# EasyEDA Pro project Distribution-board_2026-02-21.epro

# Schematic Distribution-board
Board Name: Board1; Create Date: 2026-01-16; Page Name: P1; Project Name: 莺飞; Schematic Name: Schematic7; Update Date: 2026-01-16; BladeWidth: 10; Company: 嘉立创EDA; Page Size: A4; RegionStart: 1; ShowBorder: 1; TitleBlock: 1; TitleBlockPosition: 3; Version: V1.0; XRegionCount: 6; YRegionCount: 4
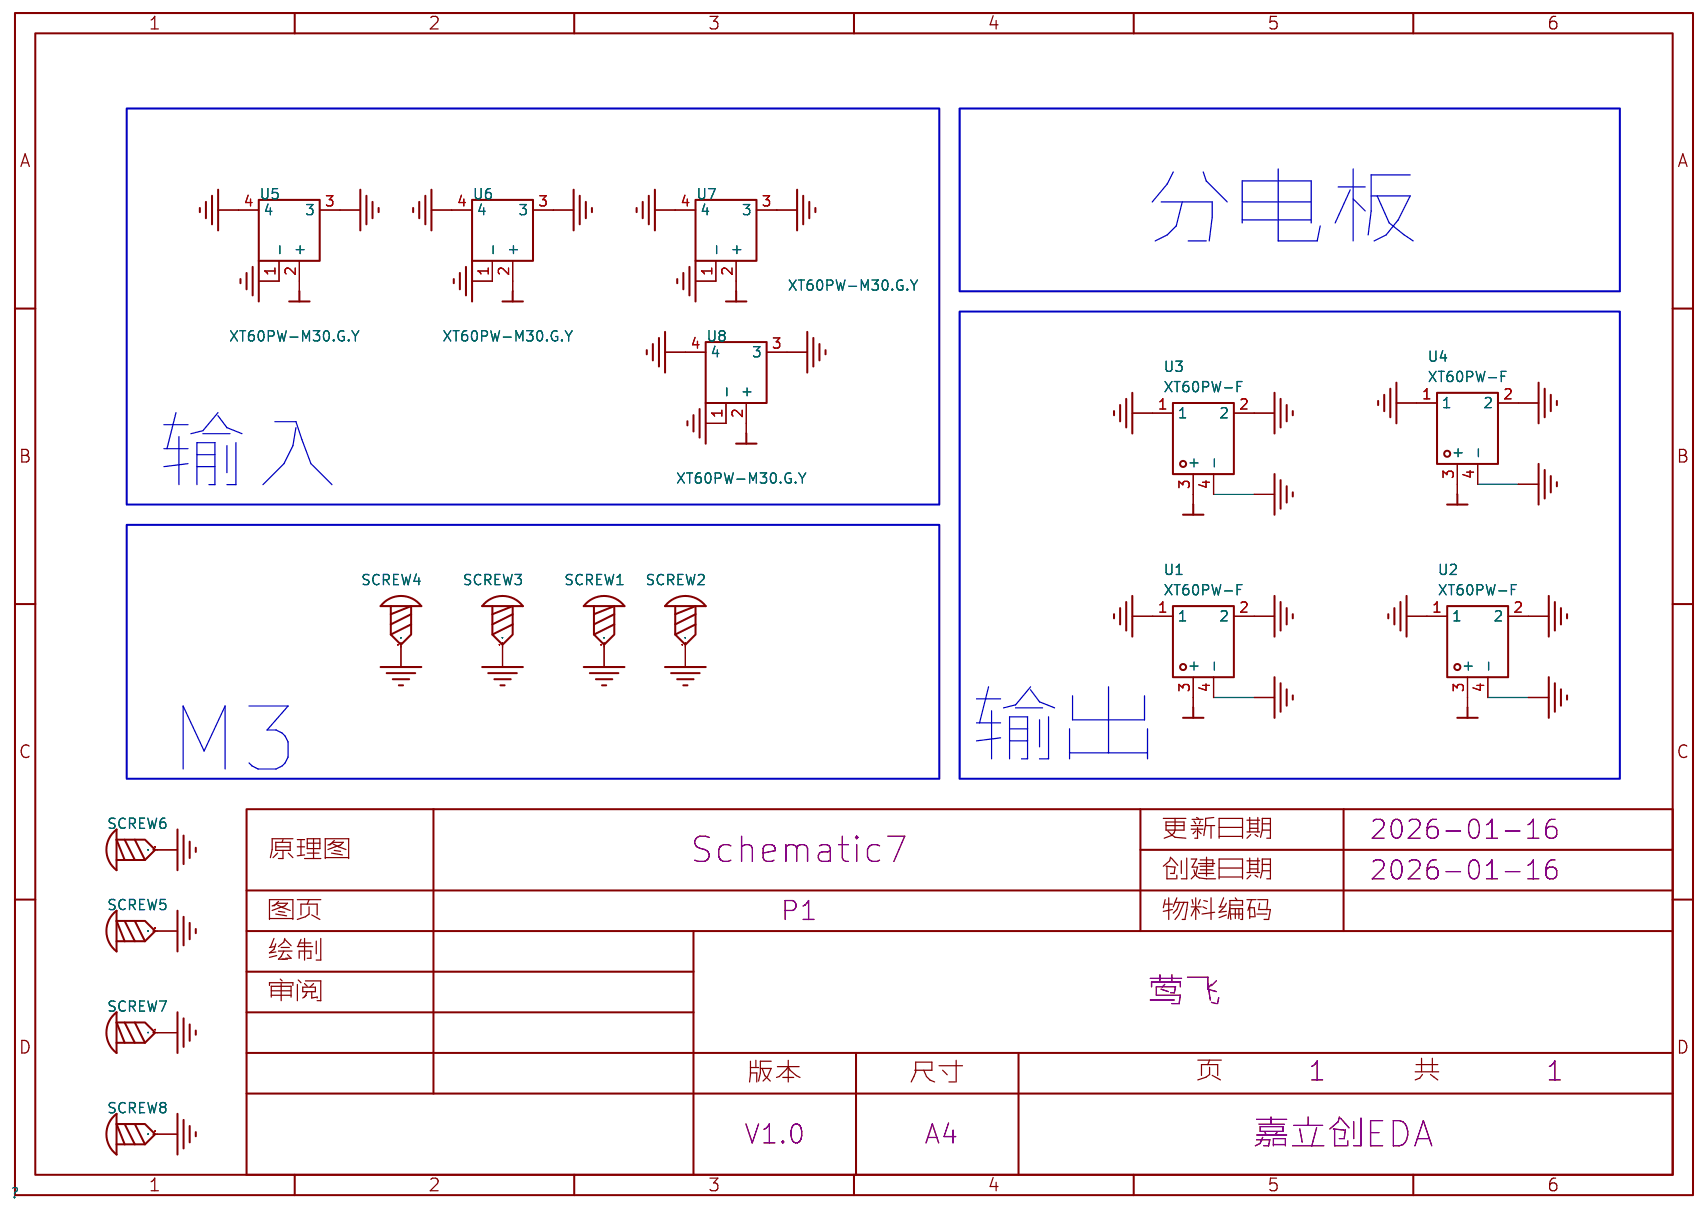
[diagram p0: schematic sheet]

## Parts
SCREW1  -  [M3螺丝_1]
SCREW2  -  [M3螺丝_1]
SCREW3  -  [M3螺丝_1]
SCREW4  -  [M3螺丝_1]
SCREW5  -  [M3螺丝_1]
SCREW6  -  [M3螺丝_1]
SCREW7  -  [M3螺丝_1]
SCREW8  -  [M3螺丝_1]
U1  XT60PW-F  [TH_2P-XT60PW-F]
U2  XT60PW-F  [TH_2P-XT60PW-F]
U3  XT60PW-F  [TH_2P-XT60PW-F]
U4  XT60PW-F  [TH_2P-XT60PW-F]
U5  XT60PW-M30.G.Y  [CONN-TH_XT60PW-M]
U6  XT60PW-M30.G.Y  [CONN-TH_XT60PW-M]
U7  XT60PW-M30.G.Y  [CONN-TH_XT60PW-M]
U8  XT60PW-M30.G.Y  [CONN-TH_XT60PW-M]

## Library data of the parts
SCREW1-SCREW8 = M3螺丝_1: Supplier Footprint: 插件
U1-U4 = XT60PW-F: LCSC Part Name: AMASS(艾迈斯)插头连接器锂电池组充电接口 航模电调卧式焊板 母头 XT60PW-F; Supplier Part: C428722; Manufacturer: AMASS(艾迈斯); JLCPCB Part Class: 扩展库; Datasheet: https://item.szlcsc.com/datasheet/XT60PW-F/423834.html; Supplier: LCSC; Type: 卧式插头; Colour: 黄色; InterfaceType: 母头
U5-U8 = XT60PW-M30.G.Y: Supplier Part: C7204007; Supplier Footprint: 插件; JLCPCB Part Class: Extended Part; Supplier: LCSC

## Nets
12V: U1.3(+) U2.3(+) U3.3(+) U4.3(+) U5.2(+) U6.2(+) U7.2(+) U8.2(+)
GND: SCREW1.1 SCREW2.1 SCREW3.1 SCREW4.1 SCREW5.1 SCREW6.1 SCREW7.1 SCREW8.1 U1.1 U1.2 U1.4(-) U2.1 U2.2 U2.4(-) U3.1 U3.2 U3.4(-) U4.1 U4.2 U4.4(-) U5.1(-) U5.3 U5.4 U6.1(-) U6.3 U6.4 U7.1(-) U7.3 U7.4 U8.1(-) U8.3 U8.4

## Notes on the sheet
- 分电板
- 输入
- M3
- 输出

# Board Distribution-board
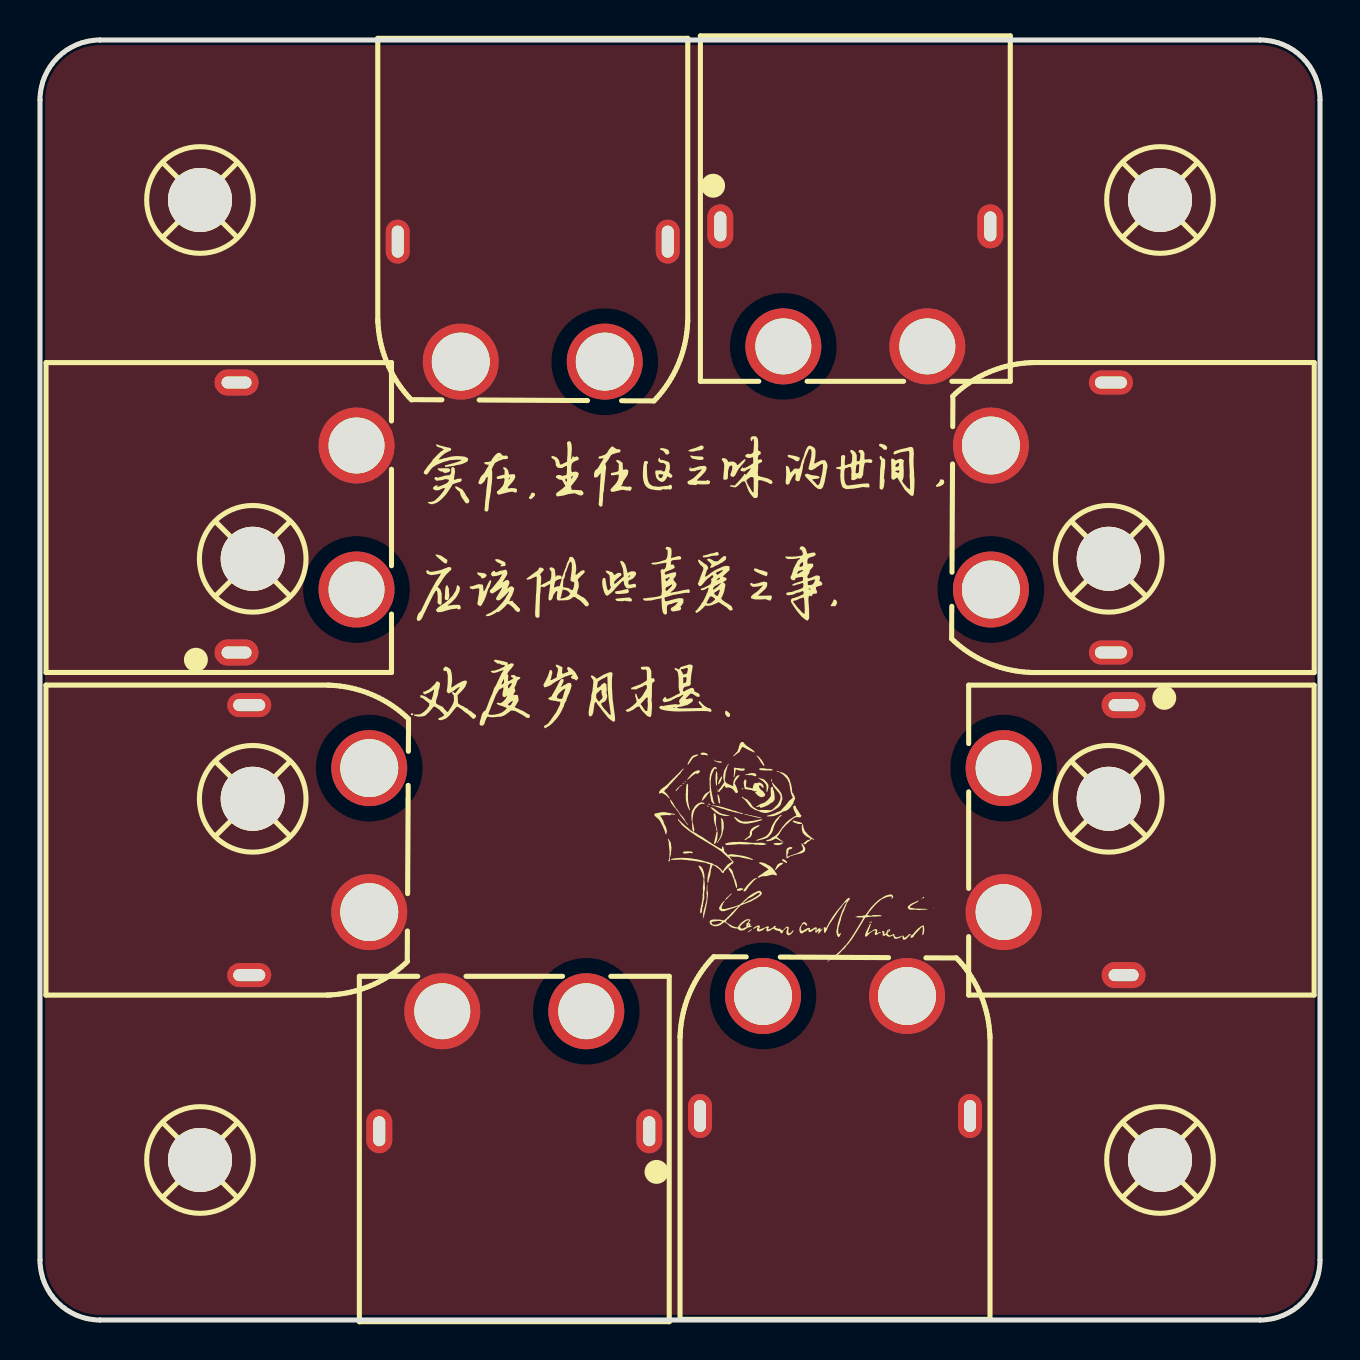
[diagram p1: board, top side]
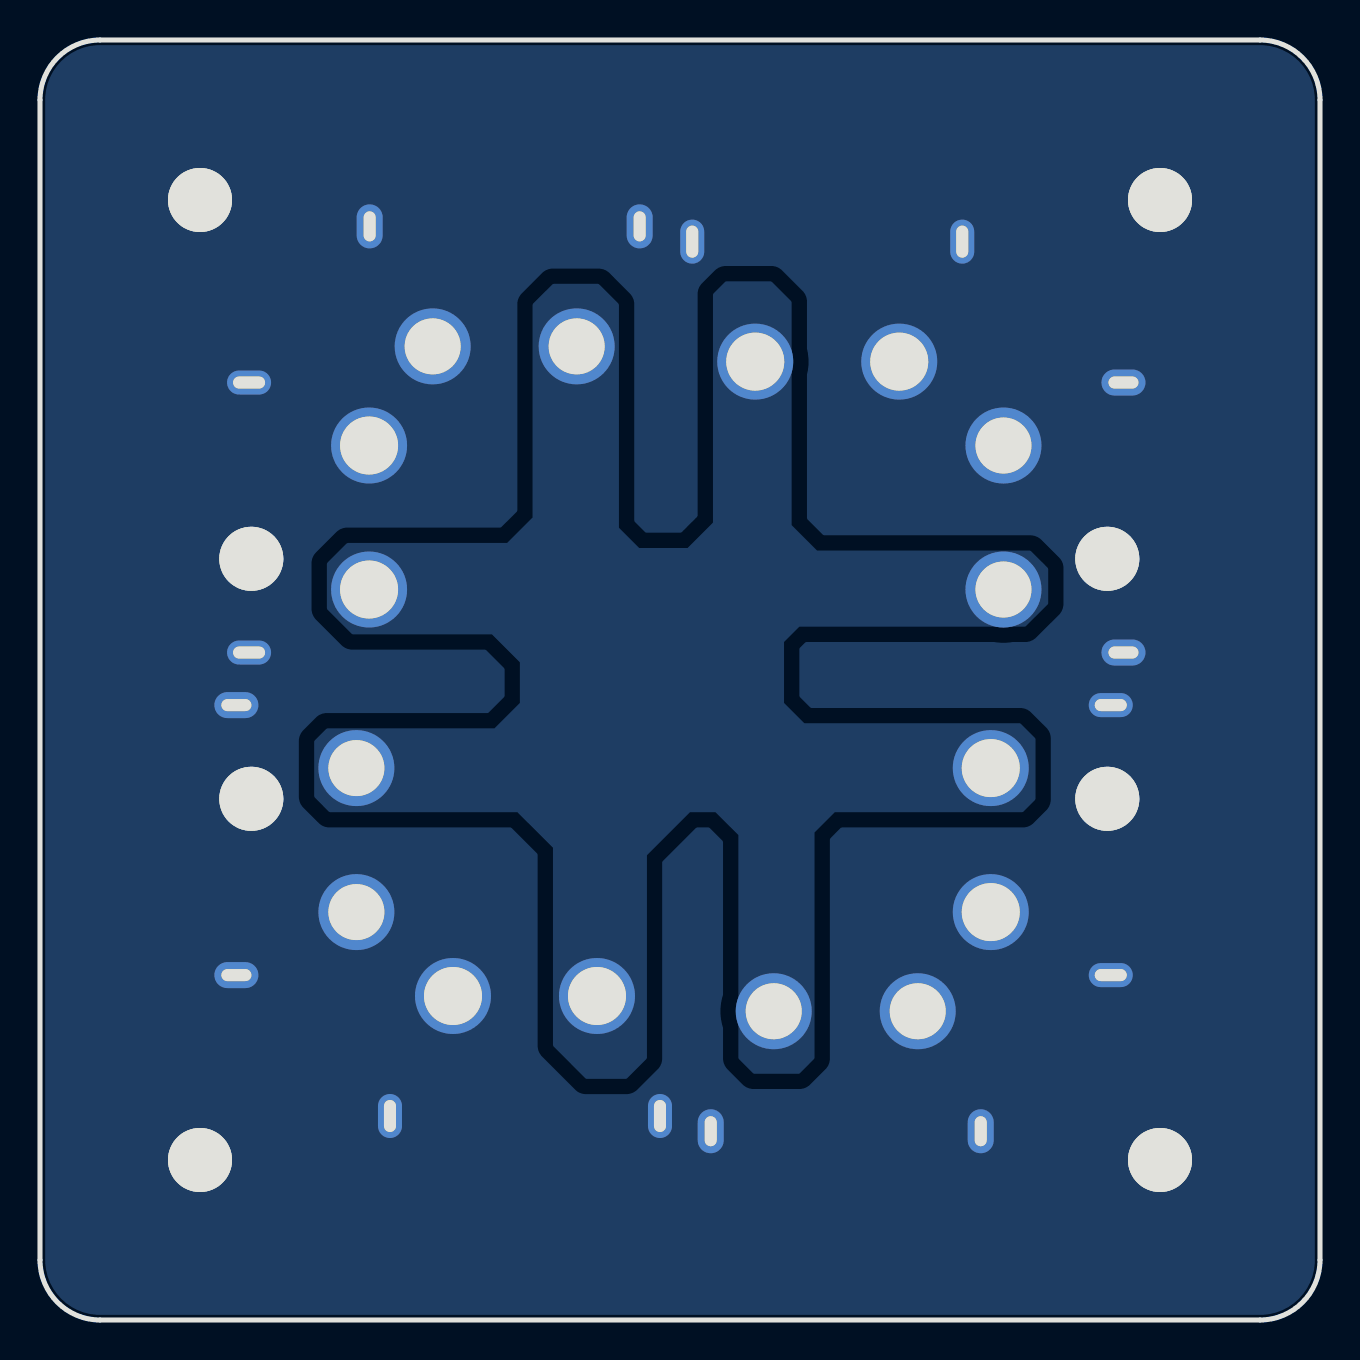
[diagram p2: board, bottom side, seen from below]

Outline 64 x 64 mm; copper layers: Top Layer, Bottom Layer. Coordinates in mm from the lower left corner of the outline.
Outline path: 0,61 0,3 arc(0.88,0.88) 3,0 61,0 arc(63.12,0.88) 64,3 64,61 arc(63.12,63.12) 61,64 3,64 arc(0.88,63.12) 0,61
Stack: Top Layer 0.035mm / Dielectric1 1.51mm FR4 er 4.5 / Bottom Layer 0.035mm

## Design rules (mm)
spacing copperThickness1oz (default): track to track 0.102, other pairs 0.152 to 0.3
spacing copperThickness2oz: track to track 0.203, other pairs 0.152 to 0.3
track width copperThickness1oz (default): min 0.127, default 0.254, max 2.54
track width copperThickness2oz: min 0.203, default 0.254, max 2.54
differential pair differentialPair (default): width min 0.127, default 0.254, max 2.54; gap min 0.152, default 0.152
net GND uses copperRegion
net 12V uses copperRegion

## Placement (name value [footprint] x y rotation side)
SCREW1  -  [M3螺丝_1]  8 56 0 top
SCREW2  -  [M3螺丝_1]  56 56 0 top
SCREW3  -  [M3螺丝_1]  56 8 0 top
SCREW4  -  [M3螺丝_1]  8 8 0 top
SCREW5  -  [M3螺丝_1]  10.64 38.06 90 top
SCREW6  -  [M3螺丝_1]  10.64 26.06 90 top
SCREW7  -  [M3螺丝_1]  53.44 26.06 90 top
SCREW8  -  [M3螺丝_1]  53.44 38.06 90 top
U1  XT60PW-F  [TH_2P-XT60PW-F]  51.18 24 270 top
U2  XT60PW-F  [TH_2P-XT60PW-F]  23.71 12.44 180 top
U3  XT60PW-F  [TH_2P-XT60PW-F]  12.83 40.12 90 top
U4  XT60PW-F  [TH_2P-XT60PW-F]  40.77 51.68 0 top
U5  XT60PW-M30.G.Y  [CONN-TH_XT60PW-M]  13.46 24 0 top
U6  XT60PW-M30.G.Y  [CONN-TH_XT60PW-M]  24.64 50.92 270 top
U7  XT60PW-M30.G.Y  [CONN-TH_XT60PW-M]  39.75 13.2 90 top
U8  XT60PW-M30.G.Y  [CONN-TH_XT60PW-M]  50.55 40.12 180 top

## Footprints (pads in the part's own frame, mm; a bottom-side part is the same pattern mirrored in y, then rotated)
CONN-TH_XT60PW-M
  round 3.8 hole 2.9: 1(3,-3.6) 2(3,3.6)
  oval 2.2x1.2 hole 1.6x0.6: 3(-3,6.75) 4(-3,-6.75)
M3螺丝_1
  round 3.2 hole 3.2: 1(0,0)
TH_2P-XT60PW-F
  oval 1.3x2.2 hole 0.6x1.5: 1(-6.75,3) 2(6.75,3)
  round 3.8 hole 2.8: 3(-3.6,-3) 4(3.6,-3)

## Nets
As in the schematic.

## Copper pours and planes (outline as drawn; the poured copper is in the pictures)
12V on Bottom Layer: 14.86,25.39 14.22,26.03 14.22,29.08 14.99,29.84 25.78,29.84 26.8,30.85 26.8,33.9 26.03,34.66 14.73,34.66 13.59,35.81 13.59,37.58 14.48,38.47 25.15,38.47 26.42,39.74 26.42,50.92 27.43,51.94 29.72,51.94 30.35,51.3 30.35,39.87 31.62,38.6 34.04,38.6 35.05,39.62 35.05,50.79 36.07,51.81 38.35,51.81 39.37,50.79 39.37,40.12 40.64,38.85 48.64,38.85 49.66,37.84 49.66,35.55 48.39,34.28 41.4,34.28 40,32.89 40,30.85 41.28,29.58 49.66,29.58 50.29,28.95 50.29,26.15 49.53,25.39 40.13,25.39 38.35,23.61 38.35,13.71 36.7,12.06 34.67,12.06 33.66,13.07 33.66,23.23 31.5,25.39 30.23,25.39 29.08,24.25 29.08,13.07 28.32,12.31 26.03,12.31 25.27,13.07 25.27,24.38 24.26,25.39
GND on Top Layer: -6.98,73.02 71.5,73.02 71.5,-4.58 -6.98,-4.58
GND on Bottom Layer: -3.94,70.73 69.22,70.73 69.22,-2.29 -3.94,-2.29
